# Altium project keyboard84.PrjPCB
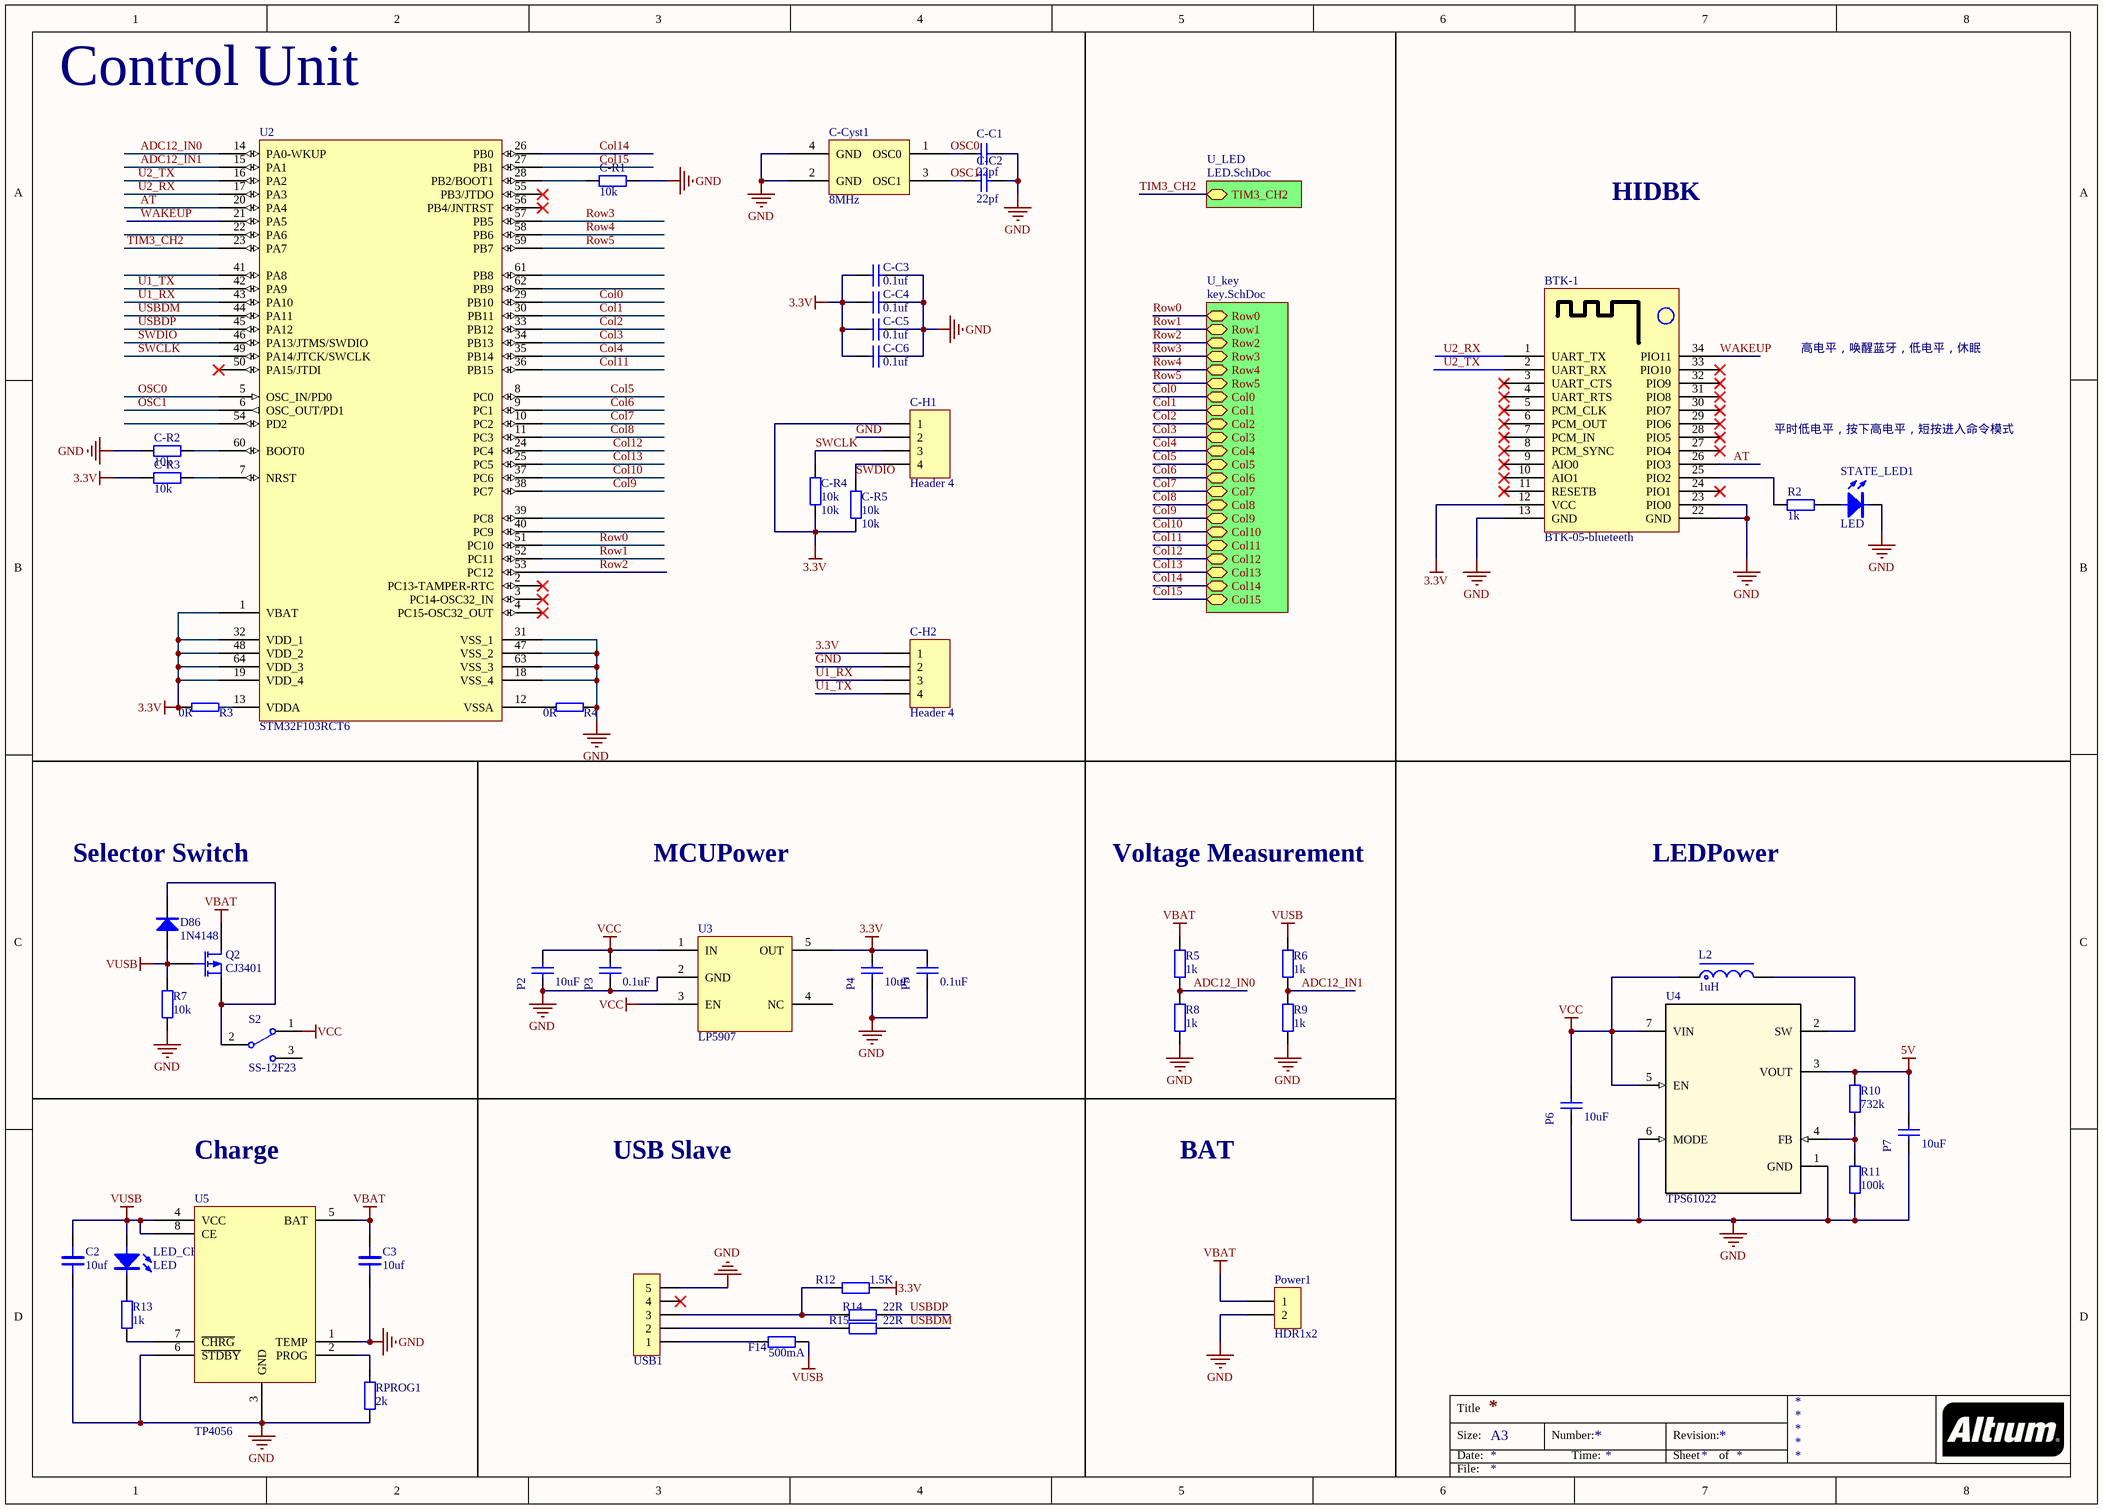
[diagram p0: keyboard84.SchDoc]
3 sheets, 303 parts. Net scope: hierarchical (ports join the sheet entries above them; power ports are global).
Board file: keyboard84.PcbDoc
Sheets:
  keyboard84.SchDoc
    U_key = key.SchDoc
    U_LED = LED.SchDoc

## Sheet keyboard84.SchDoc
size A3

### Parts
BTK-1  BTK-05-blueteeth  [BTK-05-bluteeth]
C2  10uf  [C 0603_L]
C3  10uf  [C 0603_L]
C-C1  22pf  [C 0402_L]
C-C2  22pf  [C 0402_L]
C-C3  0.1uf  [C 0402_L]
C-C4  0.1uf  [C 0402_L]
C-C5  0.1uf  [C 0402_L]
C-C6  0.1uf  [C 0402_L]
C-Cyst1  8MHz  [OSC 3225-4P]
C-H1  Header 4  [GH1.25-4P - duplicate]
C-H2  Header 4  [GH1.25-4P - duplicate]
C-R1  10k  [R 0402_L]
C-R2  10k  [R 0402_L]
C-R3  10k  [R 0402_L]
C-R4  10k  [R 0402_L]
C-R5  10k  [R 0402_L]
D86  1N4148  [SOD-323]
F14  500mA  [R 0603_L]
L2  1uH  [CD31]
LED_CHRG1  LED  [LED 0603W]
P2  10uF  [C 0603_L]
P3  0.1uF  [C 0603_L]
P4  10uF  [C 0603_L]
P5  0.1uF  [C 0603_L]
P6  10uF  [C 0603_L]
P7  10uF  [C 0603_L]
Power1  HDR1x2  [HDR2.54-LI-2P]
Q2  CJ3401  [SOT23-3]
R2  1k  [R 0603_L]
R3  0R  [R 0402_L]
R4  0R  [R 0402_L]
R5  1k  [R 0603_L]
R6  1k  [R 0603_L]
R7  10k  [R 0603_L]
R8  1k  [R 0603_L]
R9  1k  [R 0603_L]
R10  732k  [R 0603_L]
R11  100k  [R 0603_L]
R12  1.5K  [R 0402_L]
R13  1k  [R 0603_L]
R14  22R  [R 0402_L]
R15  22R  [R 0402_L]
RPROG1  2k  [R 0603_L]
S2  SS-12F23  [SS-12D10]
STATE_LED1  LED  [LED 0603W]
U2  STM32F103RCT6  [LQFP64_L]
U3  LP5907  [SOT23-5N]
U4  TPS61022  [VQFN-7]
U5  TP4056  [ESOP8_N]
USB1  USB Slave_c  [USB-MICRO - duplicate]  (value not drawn)

### Sub-sheets
U_key = key.SchDoc: Row0 (bidir), Row1 (bidir), Row2 (bidir), Row3 (bidir), Row4 (bidir), Row5 (bidir), Col0 (bidir), Col1 (bidir), Col2 (bidir), Col3 (bidir), Col4 (bidir), Col5 (bidir), Col6 (bidir), Col7 (bidir), Col8 (bidir), Col9 (bidir), Col10 (bidir), Col11 (bidir), Col12 (bidir), Col13 (bidir), Col14 (bidir), Col15 (bidir)
U_LED = LED.SchDoc: TIM3_CH2 (bidir)

### Nets
3.3V: BTK-1.12(VCC) C-C3.2 C-C4.2 C-C5.2 C-C6.2 C-H1.1 C-H2.1 C-R3.1 C-R4.1 C-R5.1 P4.2 P5.2 R3.2 R12.1 U2.1(VBAT) U2.19(VDD_4) U2.32(VDD_1) U2.48(VDD_2) U2.64(VDD_3) U3.5(OUT)
5V: P7.2 R10.2 U4.3(VOUT)
GND: BTK-1.13(GND) BTK-1.22(GND) BTK-1.23(PIO0) C2.1 C3.1 C-C1.1 C-C2.1 C-C3.1 C-C4.1 C-C5.1 C-C6.1 C-Cyst1.2(GND) C-Cyst1.4(GND) C-H1.2 C-H2.2 C-R1.1 C-R2.1 P2.1 P3.1 P4.1 P5.1 P6.1 P7.1 Power1.2 R4.1 R7.1 R8.1 R9.1 R11.1 RPROG1.1 STATE_LED1.2(C) U2.18(VSS_4) U2.31(VSS_1) U2.47(VSS_2) U2.63(VSS_3) U3.2(GND) U4.1(GND) U4.6(MODE) U5.1(TEMP) U5.3(GND) U5.6(~{STDBY}) USB1.5
VBAT: C3.2 Power1.1 Q2.2(D) R5.2 U5.5(BAT)
VCC: L2.1 P2.2 P3.2 P6.2 S2.1 U3.1(IN) U3.3(EN) U4.5(EN) U4.7(VIN)
VUSB: C2.2 D86.1(A) F14.1 LED_CHRG1.1(A) Q2.1(G) R6.2 R7.2 U5.4(VCC) U5.8(CE)
ADC12_IN0: R5.1 R8.2 U2.14(PA0-WKUP)
ADC12_IN1: R6.1 R9.2 U2.15(PA1)
AT: BTK-1.26(PIO3) U2.20(PA4)
Col0: U2.29(PB10) ; sheet U_key/Col0
Col1: U2.30(PB11) ; sheet U_key/Col1
Col2: U2.33(PB12) ; sheet U_key/Col2
Col3: U2.34(PB13) ; sheet U_key/Col3
Col4: U2.35(PB14) ; sheet U_key/Col4
Col5: U2.8(PC0) ; sheet U_key/Col5
Col6: U2.9(PC1) ; sheet U_key/Col6
Col7: U2.10(PC2) ; sheet U_key/Col7
Col8: U2.11(PC3) ; sheet U_key/Col8
Col9: U2.38(PC7) ; sheet U_key/Col9
Col10: U2.37(PC6) ; sheet U_key/Col10
Col11: U2.36(PB15) ; sheet U_key/Col11
Col12: U2.24(PC4) ; sheet U_key/Col12
Col13: U2.25(PC5) ; sheet U_key/Col13
Col14: U2.26(PB0) ; sheet U_key/Col14
Col15: U2.27(PB1) ; sheet U_key/Col15
OSC0: C-C1.2 C-Cyst1.1(OSC0) U2.5(OSC_IN/PD0)
OSC1: C-C2.2 C-Cyst1.3(OSC1) U2.6(OSC_OUT/PD1)
Row0: U2.51(PC10) ; sheet U_key/Row0
Row1: U2.52(PC11) ; sheet U_key/Row1
Row2: U2.53(PC12) ; sheet U_key/Row2
Row3: U2.57(PB5) ; sheet U_key/Row3
Row4: U2.58(PB6) ; sheet U_key/Row4
Row5: U2.59(PB7) ; sheet U_key/Row5
SWCLK: C-H1.3 C-R4.2 U2.49(PA14/JTCK/SWCLK)
SWDIO: C-H1.4 C-R5.2 U2.46(PA13/JTMS/SWDIO)
TIM3_CH2: U2.23(PA7) ; sheet U_LED/TIM3_CH2
U1_RX: C-H2.3 U2.43(PA10)
U1_TX: C-H2.4 U2.42(PA9)
U2_RX: BTK-1.1(UART_TX) U2.17(PA3)
U2_TX: BTK-1.2(UART_RX) U2.16(PA2)
USBDM: R15.1 U2.44(PA11)
USBDP: R14.1 U2.45(PA12)
WAKEUP: BTK-1.34(PIO11) U2.21(PA5)
NetBTK-1_25: BTK-1.25(PIO2) R2.1
NetC-R1_2: C-R1.2 U2.28(PB2/BOOT1)
NetC-R2_2: C-R2.2 U2.60(BOOT0)
NetC-R3_2: C-R3.2 U2.7(NRST)
NetD86_2: D86.2(K) Q2.3(S) S2.2
NetF14_2: F14.2 USB1.1
NetL2_2: L2.2 U4.2(SW)
NetLED_CHRG1_2: LED_CHRG1.2(C) R13.2
NetR2_2: R2.2 STATE_LED1.1(A)
NetR3_1: R3.1 U2.13(VDDA)
NetR4_2: R4.2 U2.12(VSSA)
NetR10_1: R10.1 R11.2 U4.4(FB)
NetR12_2: R12.2 R14.2 USB1.3
NetR13_1: R13.1 U5.7(~{CHRG})
NetR15_2: R15.2 USB1.2
NetRPROG1_2: RPROG1.2 U5.2(PROG)

Not connected (* = marked no-connect by the designer): BTK-1 3(UART_CTS)* 4(UART_RTS)* 5(PCM_CLK)* 6(PCM_OUT)* 7(PCM_IN)* 8(PCM_SYNC)* 9(AIO0)* 10(AIO1)* 11(RESETB)* 24(PIO1)* 27(PIO4)* 28(PIO5)* 29(PIO6)* 30(PIO7)* 31(PIO8)* 32(PIO9)* 33(PIO10)*; S2 3; U2 2(PC13-TAMPER-RTC)* 3(PC14-OSC32_IN)* 4(PC15-OSC32_OUT)* 22(PA6) 39(PC8) 40(PC9) 41(PA8) 50(PA15/JTDI)* 54(PD2) 55(PB3/JTDO)* 56(PB4/JNTRST)* 61(PB8) 62(PB9); U3 4(NC); USB1 4*

### Notes on the sheet
- Control Unit
- HIDBK
- 高电平，唤醒蓝牙，低电平，休眠
- 平时低电平，按下高电平，短按进入命令模式
- (near D86) Selector Switch
- MCUPower
- Voltage Measurement
- LEDPower
- Charge
- USB Slave
- BAT
- Title
- Size:
- Date:
- A3
- Number:
- Time:
- Revision:
- Sheet
- of
- File:

### Library data of the parts
C2 C3 = CAP: Capacitor
C-C1 C-C2 P2-P7 = Cap: LastUpadateTime: 2018-5-12; Package: SOC
  C-C1 C-C2: val: 22pf
  P2 P4 P6 P7: val: 10uF
  P3 P5: val: 0.1uF
C-C3-C-C6 = Cap: Capacitor; Published: 8-Jun-2000; LatestRevisionDate: 17-Jul-2002; LatestRevisionNote: Re-released for DXP Platform.; PackageReference: RAD-0.3; Publisher: Altium Limited; PackageDescription: Radial Cap, Thru-Hole; 2 Leads; 0.3 in Pin Spacing; Value: 0.1uf
C-Cyst1 = Crystal
C-H1 C-H2 = Header 4: Header, 4-Pin; LatestRevisionDate: 17-Jul-2002; LatestRevisionNote: Re-released for DXP Platform.; Publisher: Altium Limited
C-R1-C-R5 F14 R12 R14 R15 = Res2: Resistor
  C-R1-C-R5: Published: 8-Jun-2000; LatestRevisionDate: 17-Jul-2002; LatestRevisionNote: Re-released for DXP Platform.; PackageReference: AXIAL-0.4; Publisher: Altium Limited; PackageDescription: Axial Device, Thru-Hole; 2 Leads; 0.4 in Pin Spacing; Value: 10k
D86 = 1N4148: 开关二极管; BOM名称: 高速开关二极管; 淘宝ID: 封装库来自淘宝 ID：黄晶宝石; 欢迎光临: https://shop463601444.taobao.com
L2 = L-SMD: CD系列贴片线绕功率电感; BOM名称: 功率电感; 淘宝ID: 封装库来自淘宝 ID：黄晶宝石; 学习资源: www.ooocke.com
Power1 = HDR1x2: Connector
Q2 = MOSFET-P: P-Channel MOSFET; Published: 8-Jun-2000; LatestRevisionDate: 17-Jul-2002; LatestRevisionNote: Re-released for DXP Platform.; PackageVersion: 1995/1996; PackageReference: E3; Publisher: Altium Limited
R2 R5-R11 R13 RPROG1 = RES: Resistor
R3 R4 = R
S2 = SSW-1P: 1路波动开关; BOM名称: 波动开关; 版权归属: 封装库来自淘宝 ID：黄晶宝石; 学习资源: https://shop463601444.taobao.com
U2 = STM32F103RxTx: MCU
U3 = LP5907MFX
USB1 = Header 5: 5P接插件; 学习资源: 封装库来自淘宝 ID：黄晶宝石; BOM名称: 5P接插件; 联系售后: https://shop463601444.taobao.com

## Sheet key.SchDoc
size A2
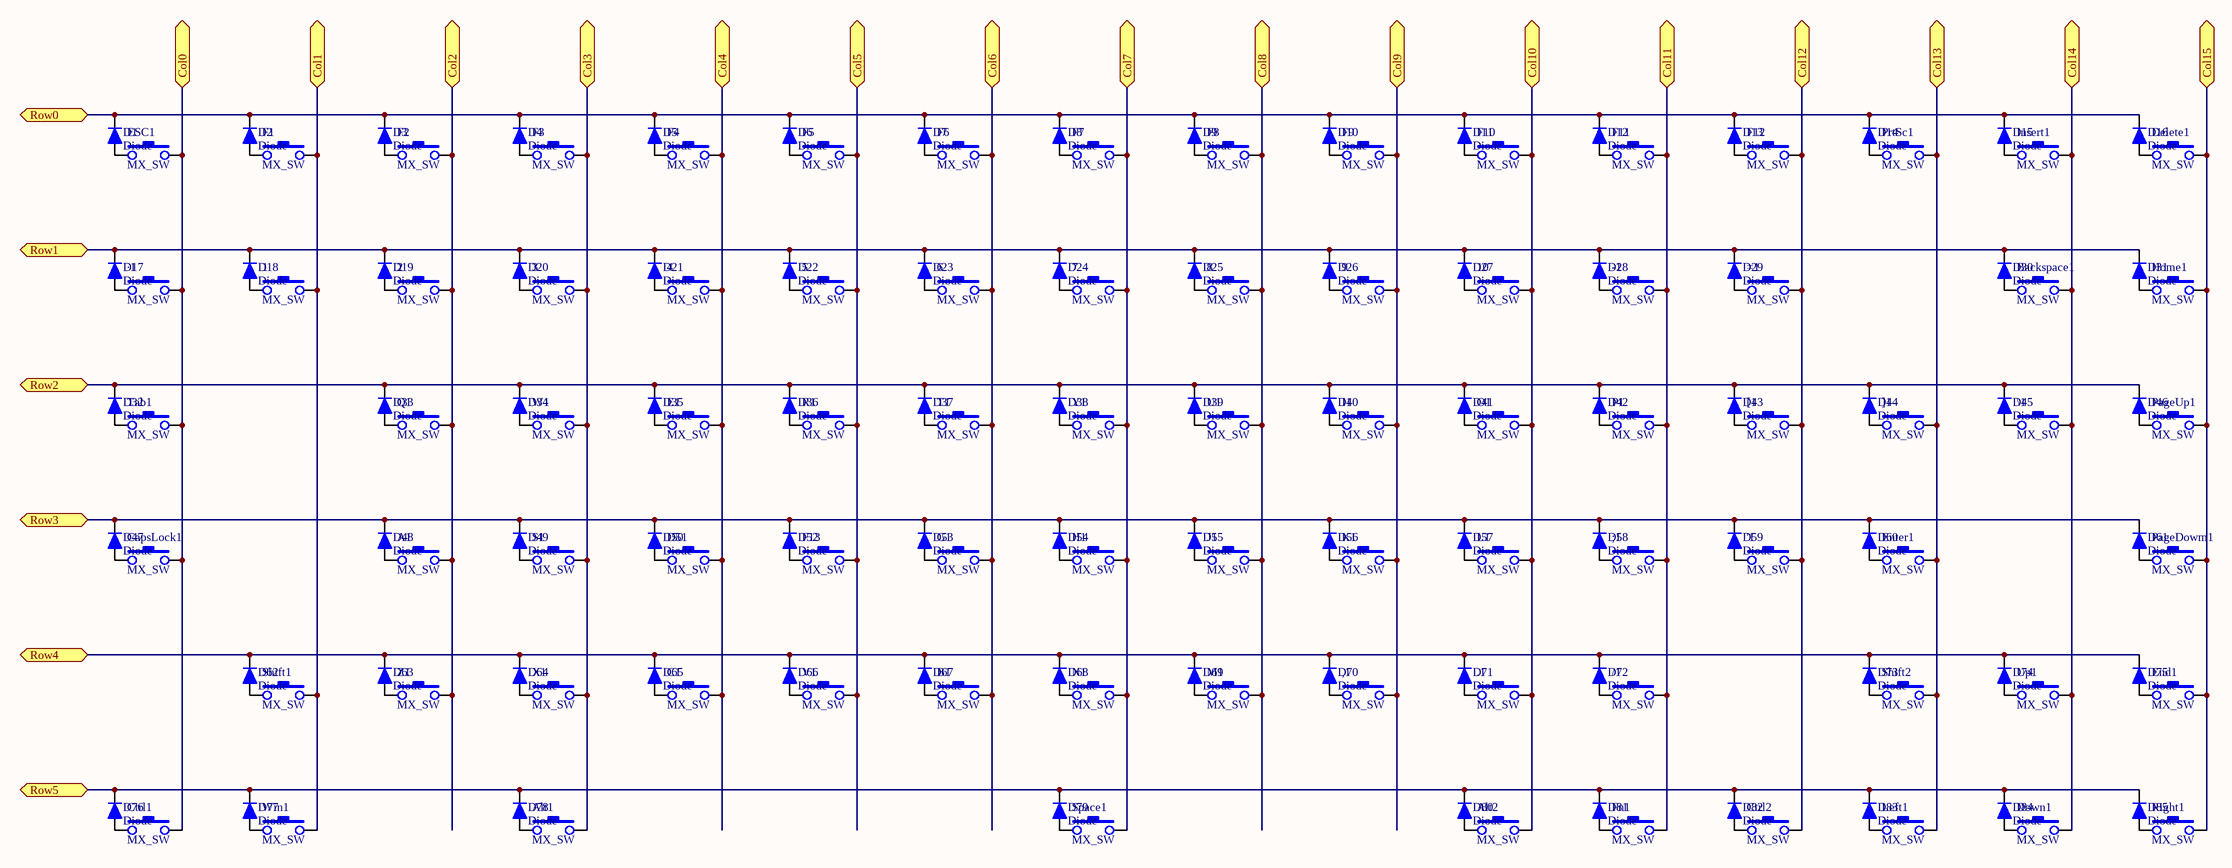
[diagram p1: key.SchDoc]

### Parts
1  MX_SW  [MX_SW-1]
2  MX_SW  [MX_SW-1]
3  MX_SW  [MX_SW-1]
4  MX_SW  [MX_SW-1]
5  MX_SW  [MX_SW-1]
6  MX_SW  [MX_SW-1]
7  MX_SW  [MX_SW-1]
8  MX_SW  [MX_SW-1]
9  MX_SW  [MX_SW-1]
10  MX_SW  [MX_SW-1]
'1  MX_SW  [MX_SW-1]
,1  MX_SW  [MX_SW-1]
-1  MX_SW  [MX_SW-1]
.1  MX_SW  [MX_SW-1]
/1  MX_SW  [MX_SW-1]
;1  MX_SW  [MX_SW-1]
=1  MX_SW  [MX_SW-1]
[1  MX_SW  [MX_SW-1]
\1  MX_SW  [MX_SW-1]
]1  MX_SW  [MX_SW-1]
A1  MX_SW  [MX_SW-1]
Alt1  MX_SW  [MX_SW-1]
Alt2  MX_SW  [MX_SW-1]
B1  MX_SW  [MX_SW-1]
Backspace1  MX_SW  [MX_SW-1]
C1  MX_SW  [MX_SW-1]
CapsLock1  MX_SW  [MX_SW-1]
Ctrl1  MX_SW  [MX_SW-1]
Ctrl2  MX_SW  [MX_SW-1]
D1  Diode  [0805-diode]
D2  Diode  [0805-diode]
D3  Diode  [0805-diode]
D4  Diode  [0805-diode]
D5  Diode  [0805-diode]
D6  Diode  [0805-diode]
D7  Diode  [0805-diode]
D8  Diode  [0805-diode]
D9  Diode  [0805-diode]
D10  Diode  [0805-diode]
D11  Diode  [0805-diode]
D12  Diode  [0805-diode]
D13  Diode  [0805-diode]
D14  Diode  [0805-diode]
D15  Diode  [0805-diode]
D16  Diode  [0805-diode]
D17  Diode  [0805-diode]
D18  Diode  [0805-diode]
D19  Diode  [0805-diode]
D20  Diode  [0805-diode]
D21  Diode  [0805-diode]
D22  Diode  [0805-diode]
D23  Diode  [0805-diode]
D24  Diode  [0805-diode]
D25  Diode  [0805-diode]
D26  Diode  [0805-diode]
D27  Diode  [0805-diode]
D28  Diode  [0805-diode]
D29  Diode  [0805-diode]
D30  Diode  [0805-diode]
D31  Diode  [0805-diode]
D32  Diode  [0805-diode]
D33  Diode  [0805-diode]
D34  Diode  [0805-diode]
D35  Diode  [0805-diode]
D36  Diode  [0805-diode]
D37  Diode  [0805-diode]
D38  Diode  [0805-diode]
D39  Diode  [0805-diode]
D40  Diode  [0805-diode]
D41  Diode  [0805-diode]
D42  Diode  [0805-diode]
D43  Diode  [0805-diode]
D44  Diode  [0805-diode]
D45  Diode  [0805-diode]
D46  Diode  [0805-diode]
D47  Diode  [0805-diode]
D48  Diode  [0805-diode]
D49  Diode  [0805-diode]
D50  Diode  [0805-diode]
D51  MX_SW  [MX_SW-1]
D52  Diode  [0805-diode]
D53  Diode  [0805-diode]
D54  Diode  [0805-diode]
D55  Diode  [0805-diode]
D56  Diode  [0805-diode]
D57  Diode  [0805-diode]
D58  Diode  [0805-diode]
D59  Diode  [0805-diode]
D60  Diode  [0805-diode]
D61  Diode  [0805-diode]
D62  Diode  [0805-diode]
D63  Diode  [0805-diode]
D64  Diode  [0805-diode]
D65  Diode  [0805-diode]
D66  Diode  [0805-diode]
D67  Diode  [0805-diode]
D68  Diode  [0805-diode]
D69  Diode  [0805-diode]
D70  Diode  [0805-diode]
D71  Diode  [0805-diode]
D72  Diode  [0805-diode]
D73  Diode  [0805-diode]
D74  Diode  [0805-diode]
D75  Diode  [0805-diode]
D76  Diode  [0805-diode]
D77  Diode  [0805-diode]
D78  Diode  [0805-diode]
D79  Diode  [0805-diode]
D80  Diode  [0805-diode]
D81  Diode  [0805-diode]
D82  Diode  [0805-diode]
D83  Diode  [0805-diode]
D84  Diode  [0805-diode]
D85  Diode  [0805-diode]
Delete1  MX_SW  [MX_SW-1]
Down1  MX_SW  [MX_SW-1]
E1  MX_SW  [MX_SW-1]
End1  MX_SW  [MX_SW-1]
Enter1  MX_SW  [MX_SW-1]
ESC1  MX_SW  [MX_SW-1]
F1  MX_SW  [MX_SW-1]
F2  MX_SW  [MX_SW-1]
F3  MX_SW  [MX_SW-1]
F4  MX_SW  [MX_SW-1]
F5  MX_SW  [MX_SW-1]
F6  MX_SW  [MX_SW-1]
F7  MX_SW  [MX_SW-1]
F8  MX_SW  [MX_SW-1]
F9  MX_SW  [MX_SW-1]
F10  MX_SW  [MX_SW-1]
F11  MX_SW  [MX_SW-1]
F12  MX_SW  [MX_SW-1]
F13  MX_SW  [MX_SW-1]
Fn1  MX_SW  [MX_SW-1]
G1  MX_SW  [MX_SW-1]
H1  MX_SW  [MX_SW-1]
Home1  MX_SW  [MX_SW-1]
I1  MX_SW  [MX_SW-1]
Insert1  MX_SW  [MX_SW-1]
J1  MX_SW  [MX_SW-1]
K1  MX_SW  [MX_SW-1]
L1  MX_SW  [MX_SW-1]
Left1  MX_SW  [MX_SW-1]
M1  MX_SW  [MX_SW-1]
N1  MX_SW  [MX_SW-1]
O1  MX_SW  [MX_SW-1]
P1  MX_SW  [MX_SW-1]
PageDowm1  MX_SW  [MX_SW-1]
PageUp1  MX_SW  [MX_SW-1]
PrtSc1  MX_SW  [MX_SW-1]
Q1  MX_SW  [MX_SW-1]
R1  MX_SW  [MX_SW-1]
Right1  MX_SW  [MX_SW-1]
S1  MX_SW  [MX_SW-1]
Shift1  MX_SW  [MX_SW-1]
Shift2  MX_SW  [MX_SW-1]
Space1  MX_SW  [MX_SW-1]
T1  MX_SW  [MX_SW-1]
Tab1  MX_SW  [MX_SW-1]
U1  MX_SW  [MX_SW-1]
Up1  MX_SW  [MX_SW-1]
V1  MX_SW  [MX_SW-1]
W1  MX_SW  [MX_SW-1]
Win1  MX_SW  [MX_SW-1]
X1  MX_SW  [MX_SW-1]
Y1  MX_SW  [MX_SW-1]
Z1  MX_SW  [MX_SW-1]
·1  MX_SW  [MX_SW-1]

### Ports
Col0 (bidir), Col1 (bidir), Col2 (bidir), Col3 (bidir), Col4 (bidir), Col5 (bidir), Col6 (bidir), Col7 (bidir), Col8 (bidir), Col9 (bidir), Col10 (bidir), Col11 (bidir), Col12 (bidir), Col13 (bidir), Col14 (bidir), Col15 (bidir), Row0 (bidir), Row1 (bidir), Row2 (bidir), Row3 (bidir), Row4 (bidir), Row5 (bidir)

### Nets
Col0: CapsLock1.2 Ctrl1.2 ESC1.2 Tab1.2 ·1.2 ; port Col0
Col1: 1.2 F1.2 Shift1.2 Win1.2 ; port Col1
Col2: 2.2 A1.2 F2.2 Q1.2 Z1.2 ; port Col2
Col3: 3.2 Alt1.2 F3.2 S1.2 W1.2 X1.2 ; port Col3
Col4: 4.2 C1.2 D51.2 E1.2 F4.2 ; port Col4
Col5: 5.2 F5.2 F13.2 R1.2 V1.2 ; port Col5
Col6: 6.2 B1.2 F6.2 G1.2 T1.2 ; port Col6
Col7: 7.2 F7.2 H1.2 N1.2 Space1.2 Y1.2 ; port Col7
Col8: 8.2 F8.2 J1.2 M1.2 U1.2 ; port Col8
Col9: 9.2 ,1.2 F9.2 I1.2 K1.2 ; port Col9
Col10: 10.2 .1.2 Alt2.2 F10.2 L1.2 O1.2 ; port Col10
Col11: -1.2 /1.2 ;1.2 F11.2 Fn1.2 P1.2 ; port Col11
Col12: '1.2 =1.2 [1.2 Ctrl2.2 F12.2 ; port Col12
Col13: ]1.2 Enter1.2 Left1.2 PrtSc1.2 Shift2.2 ; port Col13
Col14: \1.2 Backspace1.2 Down1.2 Insert1.2 Up1.2 ; port Col14
Col15: Delete1.2 End1.2 Home1.2 PageDowm1.2 PageUp1.2 Right1.2 ; port Col15
Row0: D1.K D2.K D3.K D4.K D5.K D6.K D7.K D8.K D9.K D10.K D11.K D12.K D13.K D14.K D15.K D16.K ; port Row0
Row1: D17.K D18.K D19.K D20.K D21.K D22.K D23.K D24.K D25.K D26.K D27.K D28.K D29.K D30.K D31.K ; port Row1
Row2: D32.K D33.K D34.K D35.K D36.K D37.K D38.K D39.K D40.K D41.K D42.K D43.K D44.K D45.K D46.K ; port Row2
Row3: D47.K D48.K D49.K D50.K D52.K D53.K D54.K D55.K D56.K D57.K D58.K D59.K D60.K D61.K ; port Row3
Row4: D62.K D63.K D64.K D65.K D66.K D67.K D68.K D69.K D70.K D71.K D72.K D73.K D74.K D75.K ; port Row4
Row5: D76.K D77.K D78.K D79.K D80.K D81.K D82.K D83.K D84.K D85.K ; port Row5
Net1_1: 1.1 D18.A
Net2_1: 2.1 D19.A
Net3_1: 3.1 D20.A
Net4_1: 4.1 D21.A
Net5_1: 5.1 D22.A
Net6_1: 6.1 D23.A
Net7_1: 7.1 D24.A
Net8_1: 8.1 D25.A
Net9_1: 9.1 D26.A
Net10_1: 10.1 D27.A
Net'1_1: '1.1 D59.A
Net,1_1: ,1.1 D70.A
Net-1_1: -1.1 D28.A
Net.1_1: .1.1 D71.A
Net/1_1: /1.1 D72.A
Net;1_1: ;1.1 D58.A
Net=1_1: =1.1 D29.A
Net[1_1: [1.1 D43.A
Ne~{t}1_1: \1.1 D45.A
Net]1_1: ]1.1 D44.A
NetA1_1: A1.1 D48.A
NetAlt1_1: Alt1.1 D78.A
NetAlt2_1: Alt2.1 D80.A
NetB1_1: B1.1 D67.A
NetBackspace1_1: Backspace1.1 D30.A
NetC1_1: C1.1 D65.A
NetCapsLock1_1: CapsLock1.1 D47.A
NetCtrl1_1: Ctrl1.1 D76.A
NetCtrl2_1: Ctrl2.1 D82.A
NetD1_A: D1.A ESC1.1
NetD2_A: D2.A F1.1
NetD3_A: D3.A F2.1
NetD4_A: D4.A F3.1
NetD5_A: D5.A F4.1
NetD6_A: D6.A F5.1
NetD7_A: D7.A F6.1
NetD8_A: D8.A F7.1
NetD9_A: D9.A F8.1
NetD10_A: D10.A F9.1
NetD11_A: D11.A F10.1
NetD12_A: D12.A F11.1
NetD13_A: D13.A F12.1
NetD14_A: D14.A PrtSc1.1
NetD15_A: D15.A Insert1.1
NetD16_A: D16.A Delete1.1
NetD17_A: D17.A ·1.1
NetD31_A: D31.A Home1.1
NetD32_A: D32.A Tab1.1
NetD33_A: D33.A Q1.1
NetD34_A: D34.A W1.1
NetD35_A: D35.A E1.1
NetD36_A: D36.A R1.1
NetD37_A: D37.A T1.1
NetD38_A: D38.A Y1.1
NetD39_A: D39.A U1.1
NetD40_A: D40.A I1.1
NetD41_A: D41.A O1.1
NetD42_A: D42.A P1.1
NetD46_A: D46.A PageUp1.1
NetD49_A: D49.A S1.1
NetD50_A: D50.A D51.1
NetD52_A: D52.A F13.1
NetD53_A: D53.A G1.1
NetD54_A: D54.A H1.1
NetD55_A: D55.A J1.1
NetD56_A: D56.A K1.1
NetD57_A: D57.A L1.1
NetD60_A: D60.A Enter1.1
NetD61_A: D61.A PageDowm1.1
NetD62_A: D62.A Shift1.1
NetD63_A: D63.A Z1.1
NetD64_A: D64.A X1.1
NetD66_A: D66.A V1.1
NetD68_A: D68.A N1.1
NetD69_A: D69.A M1.1
NetD73_A: D73.A Shift2.1
NetD74_A: D74.A Up1.1
NetD75_A: D75.A End1.1
NetD77_A: D77.A Win1.1
NetD79_A: D79.A Space1.1
NetD81_A: D81.A Fn1.1
NetD83_A: D83.A Left1.1
NetD84_A: D84.A Down1.1
NetD85_A: D85.A Right1.1

### Notes on the sheet
- Title
- Size:
- Date:
- File:
- A2
- Number:
- Time:
- Revision:
- Sheet
- of

### Library data of the parts
1-10 '1 ,1 -1 .1 /1 ;1 =1 [1 \1 ]1 A1 Alt1 Alt2 B1 Backspace1 C1 CapsLock1 Ctrl1 Ctrl2 D51 Delete1 Down1 E1 End1 Enter1 ESC1 F1-F13 Fn1 G1 H1 Home1 I1 Insert1 J1 K1 L1 Left1 M1 N1 O1 P1 PageDowm1 PageUp1 PrtSc1 Q1 R1 Right1 S1 Shift1 Shift2 Space1 T1 Tab1 U1 Up1 V1 W1 Win1 X1 Y1 Z1 ·1 = MX_SW-1: without Fixation pins  1-Pole

## Sheet LED.SchDoc
size A1
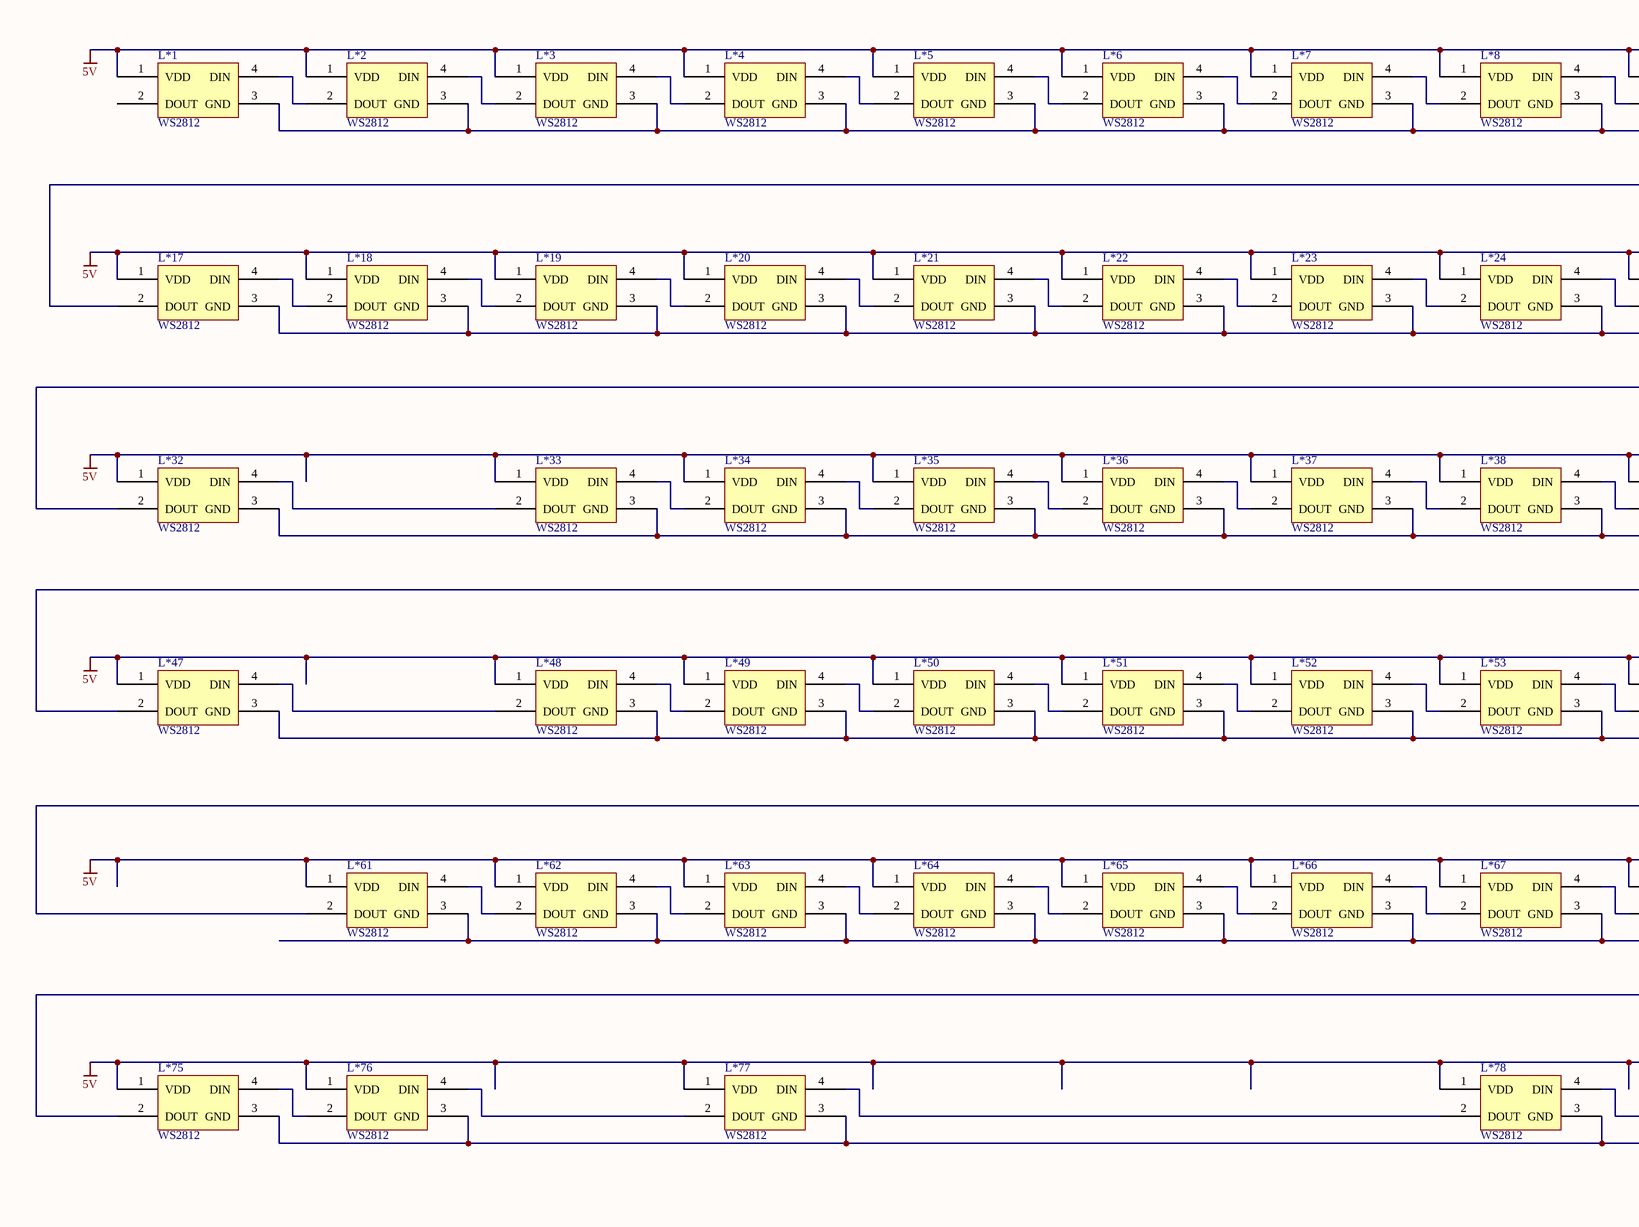
[diagram p2: LED.SchDoc, left]
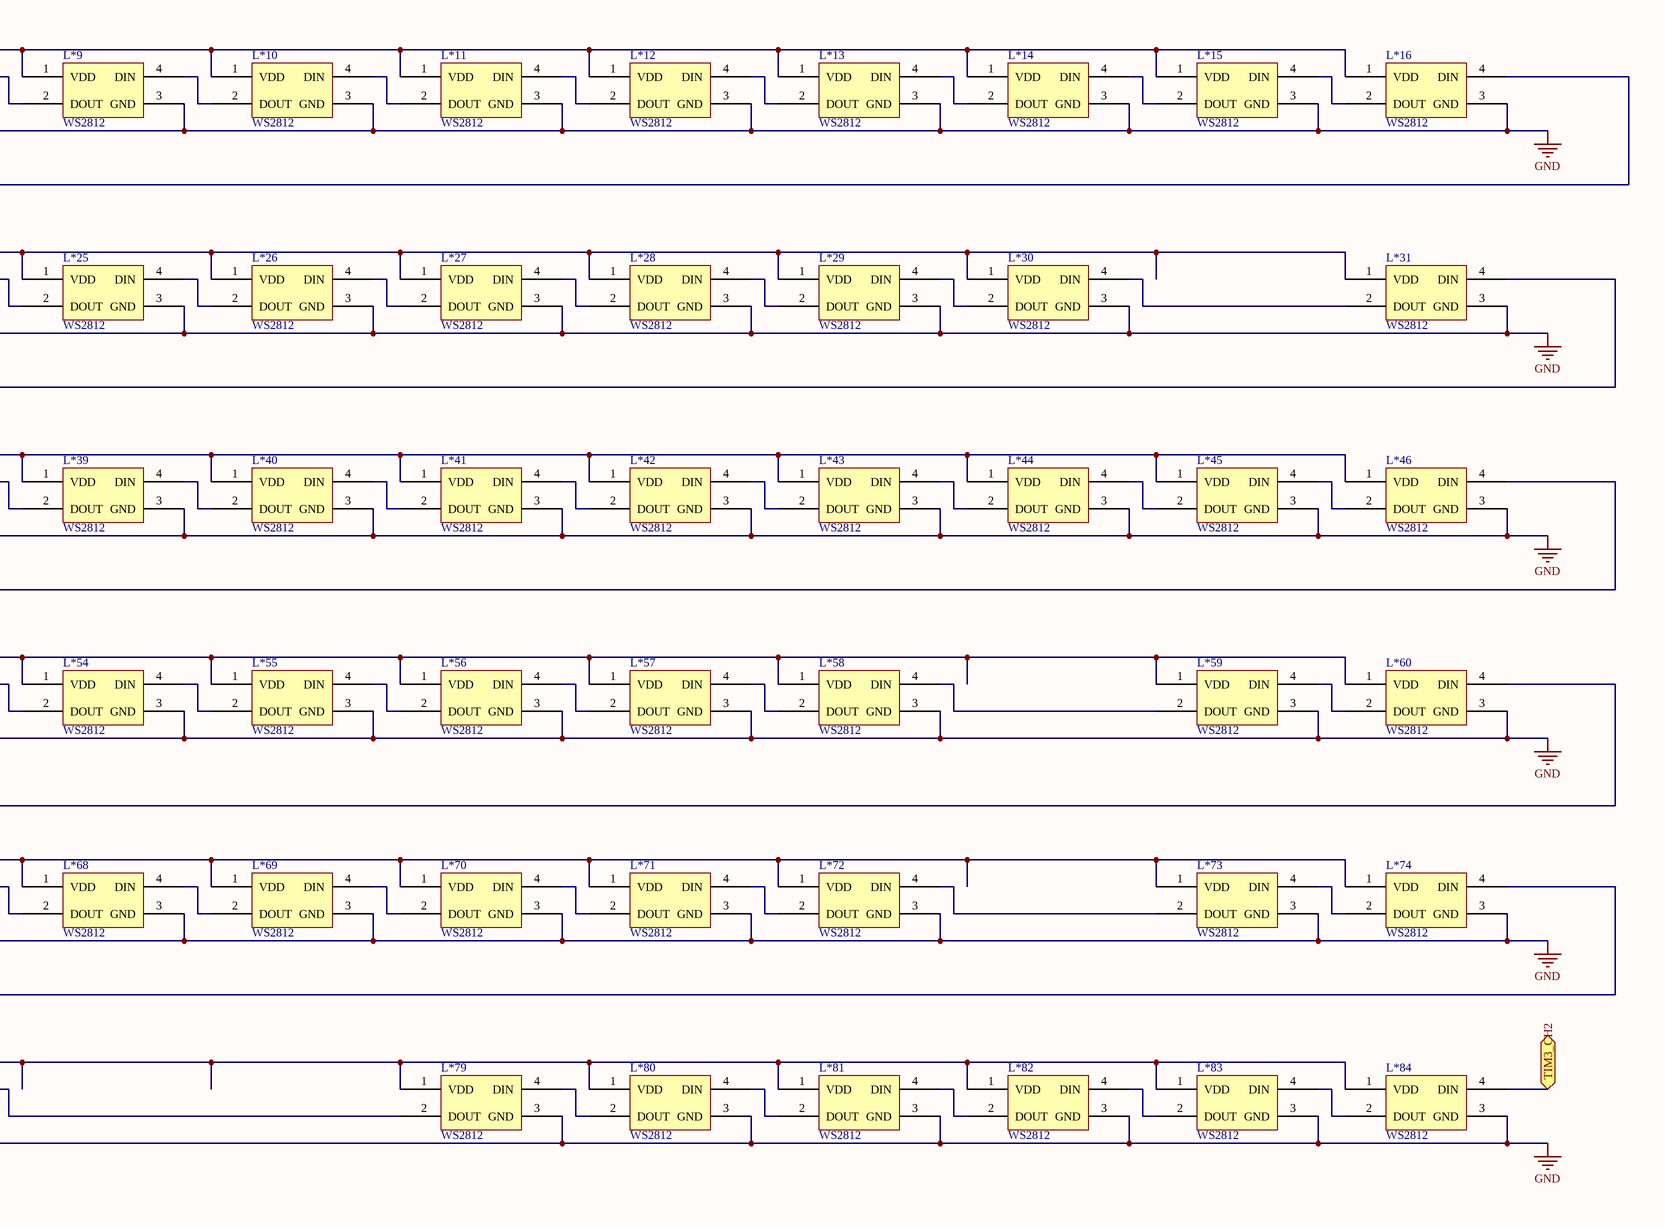
[diagram p3: LED.SchDoc, right]

### Parts
L*1  WS2812  [3528-4反贴]
L*2  WS2812  [3528-4反贴]
L*3  WS2812  [3528-4反贴]
L*4  WS2812  [3528-4反贴]
L*5  WS2812  [3528-4反贴]
L*6  WS2812  [3528-4反贴]
L*7  WS2812  [3528-4反贴]
L*8  WS2812  [3528-4反贴]
L*9  WS2812  [3528-4反贴]
L*10  WS2812  [3528-4反贴]
L*11  WS2812  [3528-4反贴]
L*12  WS2812  [3528-4反贴]
L*13  WS2812  [3528-4反贴]
L*14  WS2812  [3528-4反贴]
L*15  WS2812  [3528-4反贴]
L*16  WS2812  [3528-4反贴]
L*17  WS2812  [3528-4反贴]
L*18  WS2812  [3528-4反贴]
L*19  WS2812  [3528-4反贴]
L*20  WS2812  [3528-4反贴]
L*21  WS2812  [3528-4反贴]
L*22  WS2812  [3528-4反贴]
L*23  WS2812  [3528-4反贴]
L*24  WS2812  [3528-4反贴]
L*25  WS2812  [3528-4反贴]
L*26  WS2812  [3528-4反贴]
L*27  WS2812  [3528-4反贴]
L*28  WS2812  [3528-4反贴]
L*29  WS2812  [3528-4反贴]
L*30  WS2812  [3528-4反贴]
L*31  WS2812  [3528-4反贴]
L*32  WS2812  [3528-4反贴]
L*33  WS2812  [3528-4反贴]
L*34  WS2812  [3528-4反贴]
L*35  WS2812  [3528-4反贴]
L*36  WS2812  [3528-4反贴]
L*37  WS2812  [3528-4反贴]
L*38  WS2812  [3528-4反贴]
L*39  WS2812  [3528-4反贴]
L*40  WS2812  [3528-4反贴]
L*41  WS2812  [3528-4反贴]
L*42  WS2812  [3528-4反贴]
L*43  WS2812  [3528-4反贴]
L*44  WS2812  [3528-4反贴]
L*45  WS2812  [3528-4反贴]
L*46  WS2812  [3528-4反贴]
L*47  WS2812  [3528-4反贴]
L*48  WS2812  [3528-4反贴]
L*49  WS2812  [3528-4反贴]
L*50  WS2812  [3528-4反贴]
L*51  WS2812  [3528-4反贴]
L*52  WS2812  [3528-4反贴]
L*53  WS2812  [3528-4反贴]
L*54  WS2812  [3528-4反贴]
L*55  WS2812  [3528-4反贴]
L*56  WS2812  [3528-4反贴]
L*57  WS2812  [3528-4反贴]
L*58  WS2812  [3528-4反贴]
L*59  WS2812  [3528-4反贴]
L*60  WS2812  [3528-4反贴]
L*61  WS2812  [3528-4反贴]
L*62  WS2812  [3528-4反贴]
L*63  WS2812  [3528-4反贴]
L*64  WS2812  [3528-4反贴]
L*65  WS2812  [3528-4反贴]
L*66  WS2812  [3528-4反贴]
L*67  WS2812  [3528-4反贴]
L*68  WS2812  [3528-4反贴]
L*69  WS2812  [3528-4反贴]
L*70  WS2812  [3528-4反贴]
L*71  WS2812  [3528-4反贴]
L*72  WS2812  [3528-4反贴]
L*73  WS2812  [3528-4反贴]
L*74  WS2812  [3528-4反贴]
L*75  WS2812  [3528-4反贴]
L*76  WS2812  [3528-4反贴]
L*77  WS2812  [3528-4反贴]
L*78  WS2812  [3528-4反贴]
L*79  WS2812  [3528-4反贴]
L*80  WS2812  [3528-4反贴]
L*81  WS2812  [3528-4反贴]
L*82  WS2812  [3528-4反贴]
L*83  WS2812  [3528-4反贴]
L*84  WS2812  [3528-4反贴]

### Ports
TIM3_CH2 (bidir)

### Nets
5V: L*1.1(VDD) L*2.1(VDD) L*3.1(VDD) L*4.1(VDD) L*5.1(VDD) L*6.1(VDD) L*7.1(VDD) L*8.1(VDD) L*9.1(VDD) L*10.1(VDD) L*11.1(VDD) L*12.1(VDD) L*13.1(VDD) L*14.1(VDD) L*15.1(VDD) L*16.1(VDD) L*17.1(VDD) L*18.1(VDD) L*19.1(VDD) L*20.1(VDD) L*21.1(VDD) L*22.1(VDD) L*23.1(VDD) L*24.1(VDD) L*25.1(VDD) L*26.1(VDD) L*27.1(VDD) L*28.1(VDD) L*29.1(VDD) L*30.1(VDD) L*31.1(VDD) L*32.1(VDD) L*33.1(VDD) L*34.1(VDD) L*35.1(VDD) L*36.1(VDD) L*37.1(VDD) L*38.1(VDD) L*39.1(VDD) L*40.1(VDD) L*41.1(VDD) L*42.1(VDD) L*43.1(VDD) L*44.1(VDD) L*45.1(VDD) L*46.1(VDD) L*47.1(VDD) L*48.1(VDD) L*49.1(VDD) L*50.1(VDD) L*51.1(VDD) L*52.1(VDD) L*53.1(VDD) L*54.1(VDD) L*55.1(VDD) L*56.1(VDD) L*57.1(VDD) L*58.1(VDD) L*59.1(VDD) L*60.1(VDD) L*61.1(VDD) L*62.1(VDD) L*63.1(VDD) L*64.1(VDD) L*65.1(VDD) L*66.1(VDD) L*67.1(VDD) L*68.1(VDD) L*69.1(VDD) L*70.1(VDD) L*71.1(VDD) L*72.1(VDD) L*73.1(VDD) L*74.1(VDD) L*75.1(VDD) L*76.1(VDD) L*77.1(VDD) L*78.1(VDD) L*79.1(VDD) L*80.1(VDD) L*81.1(VDD) L*82.1(VDD) L*83.1(VDD) L*84.1(VDD)
GND: L*1.3(GND) L*2.3(GND) L*3.3(GND) L*4.3(GND) L*5.3(GND) L*6.3(GND) L*7.3(GND) L*8.3(GND) L*9.3(GND) L*10.3(GND) L*11.3(GND) L*12.3(GND) L*13.3(GND) L*14.3(GND) L*15.3(GND) L*16.3(GND) L*17.3(GND) L*18.3(GND) L*19.3(GND) L*20.3(GND) L*21.3(GND) L*22.3(GND) L*23.3(GND) L*24.3(GND) L*25.3(GND) L*26.3(GND) L*27.3(GND) L*28.3(GND) L*29.3(GND) L*30.3(GND) L*31.3(GND) L*32.3(GND) L*33.3(GND) L*34.3(GND) L*35.3(GND) L*36.3(GND) L*37.3(GND) L*38.3(GND) L*39.3(GND) L*40.3(GND) L*41.3(GND) L*42.3(GND) L*43.3(GND) L*44.3(GND) L*45.3(GND) L*46.3(GND) L*47.3(GND) L*48.3(GND) L*49.3(GND) L*50.3(GND) L*51.3(GND) L*52.3(GND) L*53.3(GND) L*54.3(GND) L*55.3(GND) L*56.3(GND) L*57.3(GND) L*58.3(GND) L*59.3(GND) L*60.3(GND) L*61.3(GND) L*62.3(GND) L*63.3(GND) L*64.3(GND) L*65.3(GND) L*66.3(GND) L*67.3(GND) L*68.3(GND) L*69.3(GND) L*70.3(GND) L*71.3(GND) L*72.3(GND) L*73.3(GND) L*74.3(GND) L*75.3(GND) L*76.3(GND) L*77.3(GND) L*78.3(GND) L*79.3(GND) L*80.3(GND) L*81.3(GND) L*82.3(GND) L*83.3(GND) L*84.3(GND)
TIM3_CH2: L*84.4(DIN) ; port TIM3_CH2
NetL*1_4: L*1.4(DIN) L*2.2(DOUT)
NetL*2_4: L*2.4(DIN) L*3.2(DOUT)
NetL*3_4: L*3.4(DIN) L*4.2(DOUT)
NetL*4_4: L*4.4(DIN) L*5.2(DOUT)
NetL*5_4: L*5.4(DIN) L*6.2(DOUT)
NetL*6_4: L*6.4(DIN) L*7.2(DOUT)
NetL*7_4: L*7.4(DIN) L*8.2(DOUT)
NetL*8_4: L*8.4(DIN) L*9.2(DOUT)
NetL*9_4: L*9.4(DIN) L*10.2(DOUT)
NetL*10_4: L*10.4(DIN) L*11.2(DOUT)
NetL*11_4: L*11.4(DIN) L*12.2(DOUT)
NetL*12_4: L*12.4(DIN) L*13.2(DOUT)
NetL*13_4: L*13.4(DIN) L*14.2(DOUT)
NetL*14_4: L*14.4(DIN) L*15.2(DOUT)
NetL*15_4: L*15.4(DIN) L*16.2(DOUT)
NetL*16_4: L*16.4(DIN) L*17.2(DOUT)
NetL*17_4: L*17.4(DIN) L*18.2(DOUT)
NetL*18_4: L*18.4(DIN) L*19.2(DOUT)
NetL*19_4: L*19.4(DIN) L*20.2(DOUT)
NetL*20_4: L*20.4(DIN) L*21.2(DOUT)
NetL*21_4: L*21.4(DIN) L*22.2(DOUT)
NetL*22_4: L*22.4(DIN) L*23.2(DOUT)
NetL*23_4: L*23.4(DIN) L*24.2(DOUT)
NetL*24_4: L*24.4(DIN) L*25.2(DOUT)
NetL*25_4: L*25.4(DIN) L*26.2(DOUT)
NetL*26_4: L*26.4(DIN) L*27.2(DOUT)
NetL*27_4: L*27.4(DIN) L*28.2(DOUT)
NetL*28_4: L*28.4(DIN) L*29.2(DOUT)
NetL*29_4: L*29.4(DIN) L*30.2(DOUT)
NetL*30_4: L*30.4(DIN) L*31.2(DOUT)
NetL*31_4: L*31.4(DIN) L*32.2(DOUT)
NetL*32_4: L*32.4(DIN) L*33.2(DOUT)
NetL*33_4: L*33.4(DIN) L*34.2(DOUT)
NetL*34_4: L*34.4(DIN) L*35.2(DOUT)
NetL*35_4: L*35.4(DIN) L*36.2(DOUT)
NetL*36_4: L*36.4(DIN) L*37.2(DOUT)
NetL*37_4: L*37.4(DIN) L*38.2(DOUT)
NetL*38_4: L*38.4(DIN) L*39.2(DOUT)
NetL*39_4: L*39.4(DIN) L*40.2(DOUT)
NetL*40_4: L*40.4(DIN) L*41.2(DOUT)
NetL*41_4: L*41.4(DIN) L*42.2(DOUT)
NetL*42_4: L*42.4(DIN) L*43.2(DOUT)
NetL*43_4: L*43.4(DIN) L*44.2(DOUT)
NetL*44_4: L*44.4(DIN) L*45.2(DOUT)
NetL*45_4: L*45.4(DIN) L*46.2(DOUT)
NetL*46_4: L*46.4(DIN) L*47.2(DOUT)
NetL*47_4: L*47.4(DIN) L*48.2(DOUT)
NetL*48_4: L*48.4(DIN) L*49.2(DOUT)
NetL*49_4: L*49.4(DIN) L*50.2(DOUT)
NetL*50_4: L*50.4(DIN) L*51.2(DOUT)
NetL*51_4: L*51.4(DIN) L*52.2(DOUT)
NetL*52_4: L*52.4(DIN) L*53.2(DOUT)
NetL*53_4: L*53.4(DIN) L*54.2(DOUT)
NetL*54_4: L*54.4(DIN) L*55.2(DOUT)
NetL*55_4: L*55.4(DIN) L*56.2(DOUT)
NetL*56_4: L*56.4(DIN) L*57.2(DOUT)
NetL*57_4: L*57.4(DIN) L*58.2(DOUT)
NetL*58_4: L*58.4(DIN) L*59.2(DOUT)
NetL*59_4: L*59.4(DIN) L*60.2(DOUT)
NetL*60_4: L*60.4(DIN) L*61.2(DOUT)
NetL*61_4: L*61.4(DIN) L*62.2(DOUT)
NetL*62_4: L*62.4(DIN) L*63.2(DOUT)
NetL*63_4: L*63.4(DIN) L*64.2(DOUT)
NetL*64_4: L*64.4(DIN) L*65.2(DOUT)
NetL*65_4: L*65.4(DIN) L*66.2(DOUT)
NetL*66_4: L*66.4(DIN) L*67.2(DOUT)
NetL*67_4: L*67.4(DIN) L*68.2(DOUT)
NetL*68_4: L*68.4(DIN) L*69.2(DOUT)
NetL*69_4: L*69.4(DIN) L*70.2(DOUT)
NetL*70_4: L*70.4(DIN) L*71.2(DOUT)
NetL*71_4: L*71.4(DIN) L*72.2(DOUT)
NetL*72_4: L*72.4(DIN) L*73.2(DOUT)
NetL*73_4: L*73.4(DIN) L*74.2(DOUT)
NetL*74_4: L*74.4(DIN) L*75.2(DOUT)
NetL*75_4: L*75.4(DIN) L*76.2(DOUT)
NetL*76_4: L*76.4(DIN) L*77.2(DOUT)
NetL*77_4: L*77.4(DIN) L*78.2(DOUT)
NetL*78_4: L*78.4(DIN) L*79.2(DOUT)
NetL*79_4: L*79.4(DIN) L*80.2(DOUT)
NetL*80_4: L*80.4(DIN) L*81.2(DOUT)
NetL*81_4: L*81.4(DIN) L*82.2(DOUT)
NetL*82_4: L*82.4(DIN) L*83.2(DOUT)
NetL*83_4: L*83.4(DIN) L*84.2(DOUT)

Not connected (* = marked no-connect by the designer): L*1 2(DOUT)

### Notes on the sheet
- Title
- Size:
- Date:
- File:
- A1
- Number:
- Time:
- Revision:
- Sheet
- of

## Nets that join several sheets
5V: keyboard84 (P7.2 R10.2 U4.3), LED (84 pins)
GND: keyboard84 (42 pins), LED (84 pins)
Col0: keyboard84 (U2.29), key (5 pins)
Col1: keyboard84 (U2.30), key (1.2 F1.2 Shift1.2 Win1.2)
Col2: keyboard84 (U2.33), key (5 pins)
Col3: keyboard84 (U2.34), key (6 pins)
Col4: keyboard84 (U2.35), key (5 pins)
Col5: keyboard84 (U2.8), key (5 pins)
Col6: keyboard84 (U2.9), key (5 pins)
Col7: keyboard84 (U2.10), key (6 pins)
Col8: keyboard84 (U2.11), key (5 pins)
Col9: keyboard84 (U2.38), key (5 pins)
Col10: keyboard84 (U2.37), key (6 pins)
Col11: keyboard84 (U2.36), key (6 pins)
Col12: keyboard84 (U2.24), key (5 pins)
Col13: keyboard84 (U2.25), key (5 pins)
Col14: keyboard84 (U2.26), key (5 pins)
Col15: keyboard84 (U2.27), key (6 pins)
Row0: keyboard84 (U2.51), key (16 pins)
Row1: keyboard84 (U2.52), key (15 pins)
Row2: keyboard84 (U2.53), key (15 pins)
Row3: keyboard84 (U2.57), key (14 pins)
Row4: keyboard84 (U2.58), key (14 pins)
Row5: keyboard84 (U2.59), key (10 pins)
TIM3_CH2: keyboard84 (U2.23), LED (L*84.4)